# EAGLE schematic powersource (EAGLE 9.2.2)
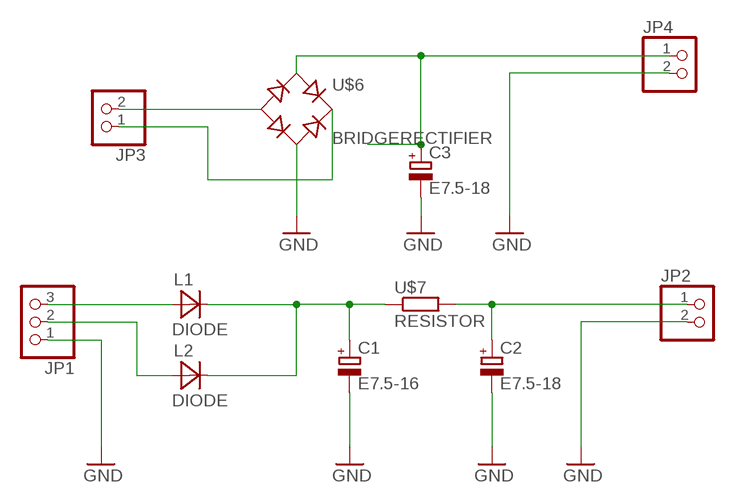
[diagram p0: schematic, sheet 1]

## Parts
C1  E7.5-16  [E7,5-16]
C2  E7.5-18  [E7,5-18]
C3  E7.5-18  [E7,5-18]
JP1  PINHD-1X3  [1X03]
JP2  PINHD-1X2  [1X02]
JP3  PINHD-1X2  [1X02]
JP4  PINHD-1X2  [1X02]
L1  DIODE  [DO07]
L2  DIODE  [DO07]
U$6  BRIDGERECTIFIER  [BRIDGERECTIFIER]
U$7  RESISTOR  [RESISTOR]

## Nets
GND: C1.- C2.- C3.- JP1.1 JP2.2 JP4.2 U$6.AC2
N$1: JP1.2 L2.A
N$2: JP1.3 L1.A
N$3: JP3.2 U$6.-
N$4: JP3.1 U$6.+
N$7: C3.+ JP4.1 U$6.AC1
N$14: C2.+ JP2.1 U$7.2
N$15: C1.+ L1.C L2.C U$7.1

## Library data of the parts
C1 = VacuumTube:E7.5-16
C2 C3 = VacuumTube:E7.5-18
JP1 = VacuumTube:PINHD-1X3: PIN HEADER
JP2-JP4 = VacuumTube:PINHD-1X2: PIN HEADER
L1 L2 = VacuumTube:DIODE
U$6 = VacuumTube:BRIDGERECTIFIER
U$7 = VacuumTube:RESISTOR